# Altium schematic sheet STM32_microcontroller_power.SchDoc: STM32 microcontroller power
size A4; Date: Not used; ApprovedBy: Not used; CheckedBy: Not used; Author: Not used; CompanyName: STMicroelectronics; DrawnBy: Not used; Engineer: Not used; Organization: Not used; Address1: Not used; Address2: Not used; Address3: Not used; Address4: Not used; DocumentNumber: 4; Revision: Not used; SheetNumber: 4; SheetTotal: 8; CurrentTime: Not used; CurrentDate: Not used; Time: Not used; DocumentFullPathAndName: Not used; DocumentName: Not used; ModifiedDate: Not used; ImagePath: Not used; ProjectName: Not used; Application_BuildNumber: Not used
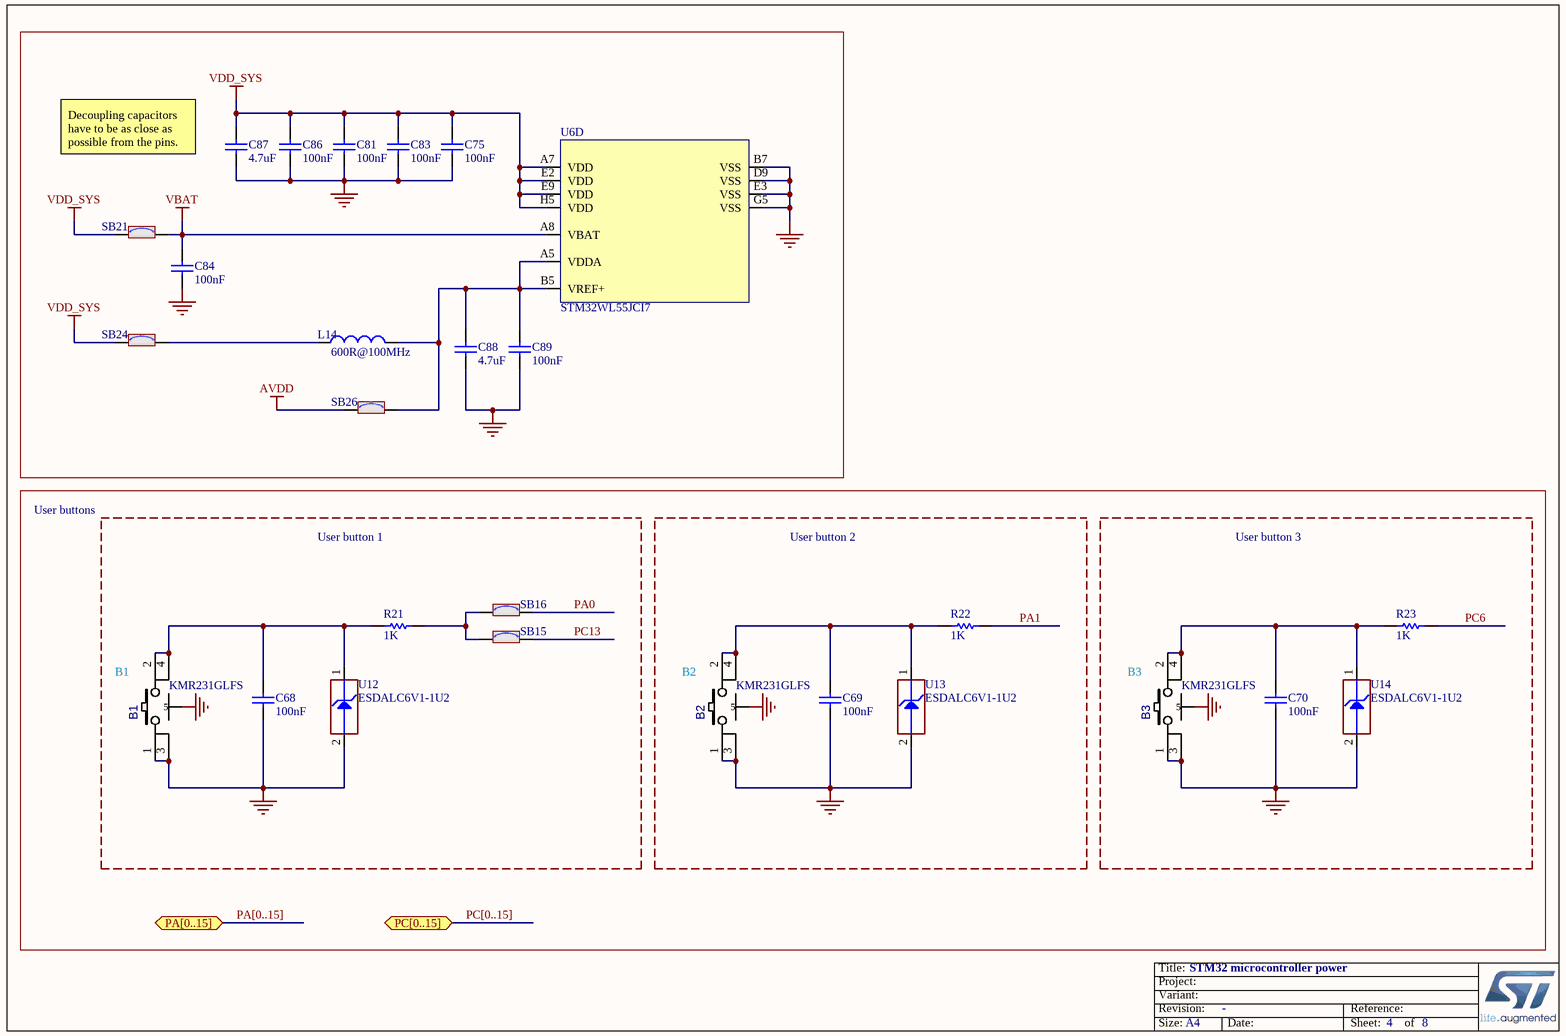
[diagram p0: STM32_microcontroller_power.SchDoc]

## Parts
B1  value KMR231GLFS  [SWI_C&K_Y78B23110FP__ITT_KMR231GLFS]
B2  value KMR231GLFS  [SWI_C&K_Y78B23110FP__ITT_KMR231GLFS]
B3  value KMR231GLFS  [SWI_C&K_Y78B23110FP__ITT_KMR231GLFS]
C68  value 100nF  [C0402]
C69  value 100nF  [C0402]
C70  value 100nF  [C0402]
C75  value 100nF  [C0402]
C81  value 100nF  [C0402]
C83  value 100nF  [C0402]
C84  value 100nF  [C0402]
C86  value 100nF  [C0402]
C87  value 4.7uF  [C0603]
C88  value 4.7uF  [C0603]
C89  value 100nF  [C0402]
L14  value 600R@100MHz  [L0603]
R21  value 1K  [R0402]
R22  value 1K  [R0402]
R23  value 1K  [R0402]
SB15  (no value)  [SOLDER-BRIDGE_R0603-0R]
SB16  (no value)  [SOLDER-BRIDGE_R0603-0R]
SB21  (no value)  [SOLDER-BRIDGE_R0603-0R]
SB24  (no value)  [SOLDER-BRIDGE_R0603-0R]
SB26  (no value)  [SOLDER-BRIDGE_R0603-0R]
U6  value STM32WL55JCI7  [ICC_UFBGA73_5X5_P050]  (part D of 5)
U12  value ESDALC6V1-1U2  [ESD_ST0201]
U13  value ESDALC6V1-1U2  [ESD_ST0201]
U14  value ESDALC6V1-1U2  [ESD_ST0201]

## Ports
PA[0..15] (bidir), PC[0..15] (bidir)

## Nets
AVDD: SB26.1
GND: B1.1 B1.3 B1.5 B2.1 B2.3 B2.5 B3.1 B3.3 B3.5 C68.1 C69.1 C70.1 C75.1 C81.1 C83.1 C84.1 C86.1 C87.1 C88.1 C89.1 U6.B7(VSS) U6.D9(VSS) U6.E3(VSS) U6.G5(VSS) U12.2(GND) U13.2(GND) U14.2(GND)
VBAT: C84.2 SB21.2 U6.A8(VBAT)
VDD_SYS: C75.2 C81.2 C83.2 C86.2 C87.2 SB21.1 SB24.1 U6.A7(VDD) U6.E2(VDD) U6.E9(VDD) U6.H5(VDD)
PA0: SB16.2
PA1: R22.2
PC6: R23.2
PC13: SB15.2
NetB1_2: B1.2 B1.4 C68.2 R21.1 U12.1(IO1)
NetB2_2: B2.2 B2.4 C69.2 R22.1 U13.1(IO1)
NetB3_2: B3.2 B3.4 C70.2 R23.1 U14.1(IO1)
NetC88_2: C88.2 C89.2 L14.2 SB26.2 U6.A5(VDDA) U6.B5(VREF+)
NetL14_1: L14.1 SB24.2
NetR21_2: R21.2 SB15.1 SB16.1

## Buses and harness runs
bus PA[0..15] = port PA[0..15]
bus PC[0..15] = port PC[0..15]

## Notes on the sheet
- (near C87) Decoupling capacitors have to be as close as possible from the pins.
- User buttons
- User button 1
- User button 2
- User button 3
- (near B1) B1
- (near B2) B2
- (near B3) B3
- Title:
- Project:
- Size:
- Revision:
- Variant:
- A4
- -
- Date:
- Reference:
- Sheet:
- of

## Library data of the parts
B1-B3 = MCD-01485: Microminiature Tact Switch for SMT - KMR 2 Series - 1.9 mm height; Part_Type: Misc; Manufacturer: C&K; Provided_By: SUBCO; Internal_Part_Number: MCD-01485; Status: Checked; Manufacturer_Part_Number: KMR231GLFS; ComponentLink1Description: Datasheet; ComponentLink1URL: http://tunmcdsvn.tun.st.com/Component_Datasheet_Library/Trunk/Misc/C&K_tactile_switch_KMR_series; ECCN_US: n/a; ECCN_EU: n/a
C68-C70 C75 C81 C83 C84 C86 C89 = MCD-00102: Capacitor, MLCC, 100nF, 16V, X7R, 10%, 0402, T=0,5mm; Manufacturer_Part_Number: CC0402KRX7R7BB104; Manufacturer: YAGEO; Alternate_Manufacturer_Part_Number: GCM155R71C104KA55D; Alternate_Manufacturer: MURATA; Provided_By: SUBCO; ECCN_US: EAR99; ECCN_EU: NEC; Internal_Part_Number: MCD-00102; Status: Released; Package: C0402; ComponentLink1Description: Datasheet; Part_Type: Capacitor; ComponentLink1URL: http://tunmcdsvn.tun.st.com/Component_Datasheet_Library/Trunk/Capacitors/Yageo_Multilayer_Capacitor_X7R_series_100pF_to_22uF
C87 C88 = MCD-00009: Capacitor, MLCC, 4.7uF, 16V, X5R, 10%, 0603, T=0.8mm; Manufacturer_Part_Number: CC0603KRX5R7BB475; Manufacturer: YAGEO; Provided_By: SUBCO; ECCN_US: EAR99; ECCN_EU: NEC; Internal_Part_Number: MCD-00009; ComponentLink1Description: Datasheet; Status: Released; Part_Type: Capacitor; Package: C0603; ComponentLink1URL: http://tunmcdsvn.tun.st.com/Component_Datasheet_Library/Trunk/Capacitors/Yageo_Multilayer_capacitor_X5R_series_100pF_to_100uF
L14 = MCD-00047: SMD Chip ferrite bead, 600R@100MHz +/-25%, 350mA, 500mohm DC, 0603, T=0.8mm; Part_Type: Inductor; Manufacturer_Part_Number: FCM1608KF-601T03; Manufacturer: TAI-TECH; Provided_By: SUBCO; Internal_Part_Number: MCD-00047; Status: Released; ComponentLink1Description: Datasheet; ComponentLink1URL: http://tunmcdsvn.tun.st.com/Component_Datasheet_Library/Trunk/Inductors/TaiTech_Bead_FCM1608_series; ECCN_US: n/a; ECCN_EU: n/a
R21-R23 = MCD-00061: Resistor,1K,0402,1%,1/16W; Manufacturer_Part_Number: RC0402FR-071KL; Manufacturer: YAGEO; Provided_By: SUBCO; ECCN_US: EAR99; ECCN_EU: NEC; Internal_Part_Number: MCD-00061; Status: Released; Part_Type: Resistor; Package: R0402; ComponentLink1Description: Datasheet; ComponentLink1URL: http://tunmcdsvn.tun.st.com/Component_Datasheet_Library/Trunk/Resistors/Yageo_Resistor_RC0402-series
SB15 SB16 SB21 SB24 SB26 = MCD-00071: Solder Bridge ON; Part_Type: Mechanical; Manufacturer_Part_Number: RC0603JR-070RL; Manufacturer: YAGEO; Provided_By: SUBCO; Internal_Part_Number: MCD-00071; Status: Released; Package: SB0603; ComponentLink1Description: Datasheet; ComponentLink1URL: http://tunmcdsvn.tun.st.com/Component_Datasheet_Library/Trunk/Resistors/Yageo_Resistor_RC0603-series; ECCN_US: n/a; ECCN_EU: n/a
U6 = MCD-01435: Multiprotocol Wireless 32-bit MCUwith LPWAN Sub-GHz radio solution; Part_Type: IC; Manufacturer: STMICROELECTRONICS; ECCN_US: tbd; Internal_Part_Number: MCD-01435; Status: Footprint available; Manufacturer_Part_Number: STM32WL55JCI7; Package: UFBGA73; ComponentLink1Description: Datasheet; ComponentLink1URL: http://tunmcdsvn.tun.st.com/Component_Datasheet_Library/Trunk/IC/STM_STM32WL5x; Provided_By: n/a; ECCN_EU: tbd
U12-U14 = MCD-00170: ESD protection 6V1; Part_Type: Diode; Manufacturer: STMICROELECTRONICS; BMS_Part_Number: 9151132; Provided_By: SUBCO with ST control; ECCN_US: EAR99; ECCN_EU: NEC; Internal_Part_Number: MCD-00170; Status: Released; Manufacturer_Part_Number: ESDALC6V1-1U2; ComponentLink1Description: Datasheet; ComponentLink1URL: http://tunmcdsvn.tun.st.com/Component_Datasheet_Library/Trunk/Diodes/STM_ESD_ESDALC6V1-1U2